# EAGLE design PiZero2 (EAGLE 7.6.0)
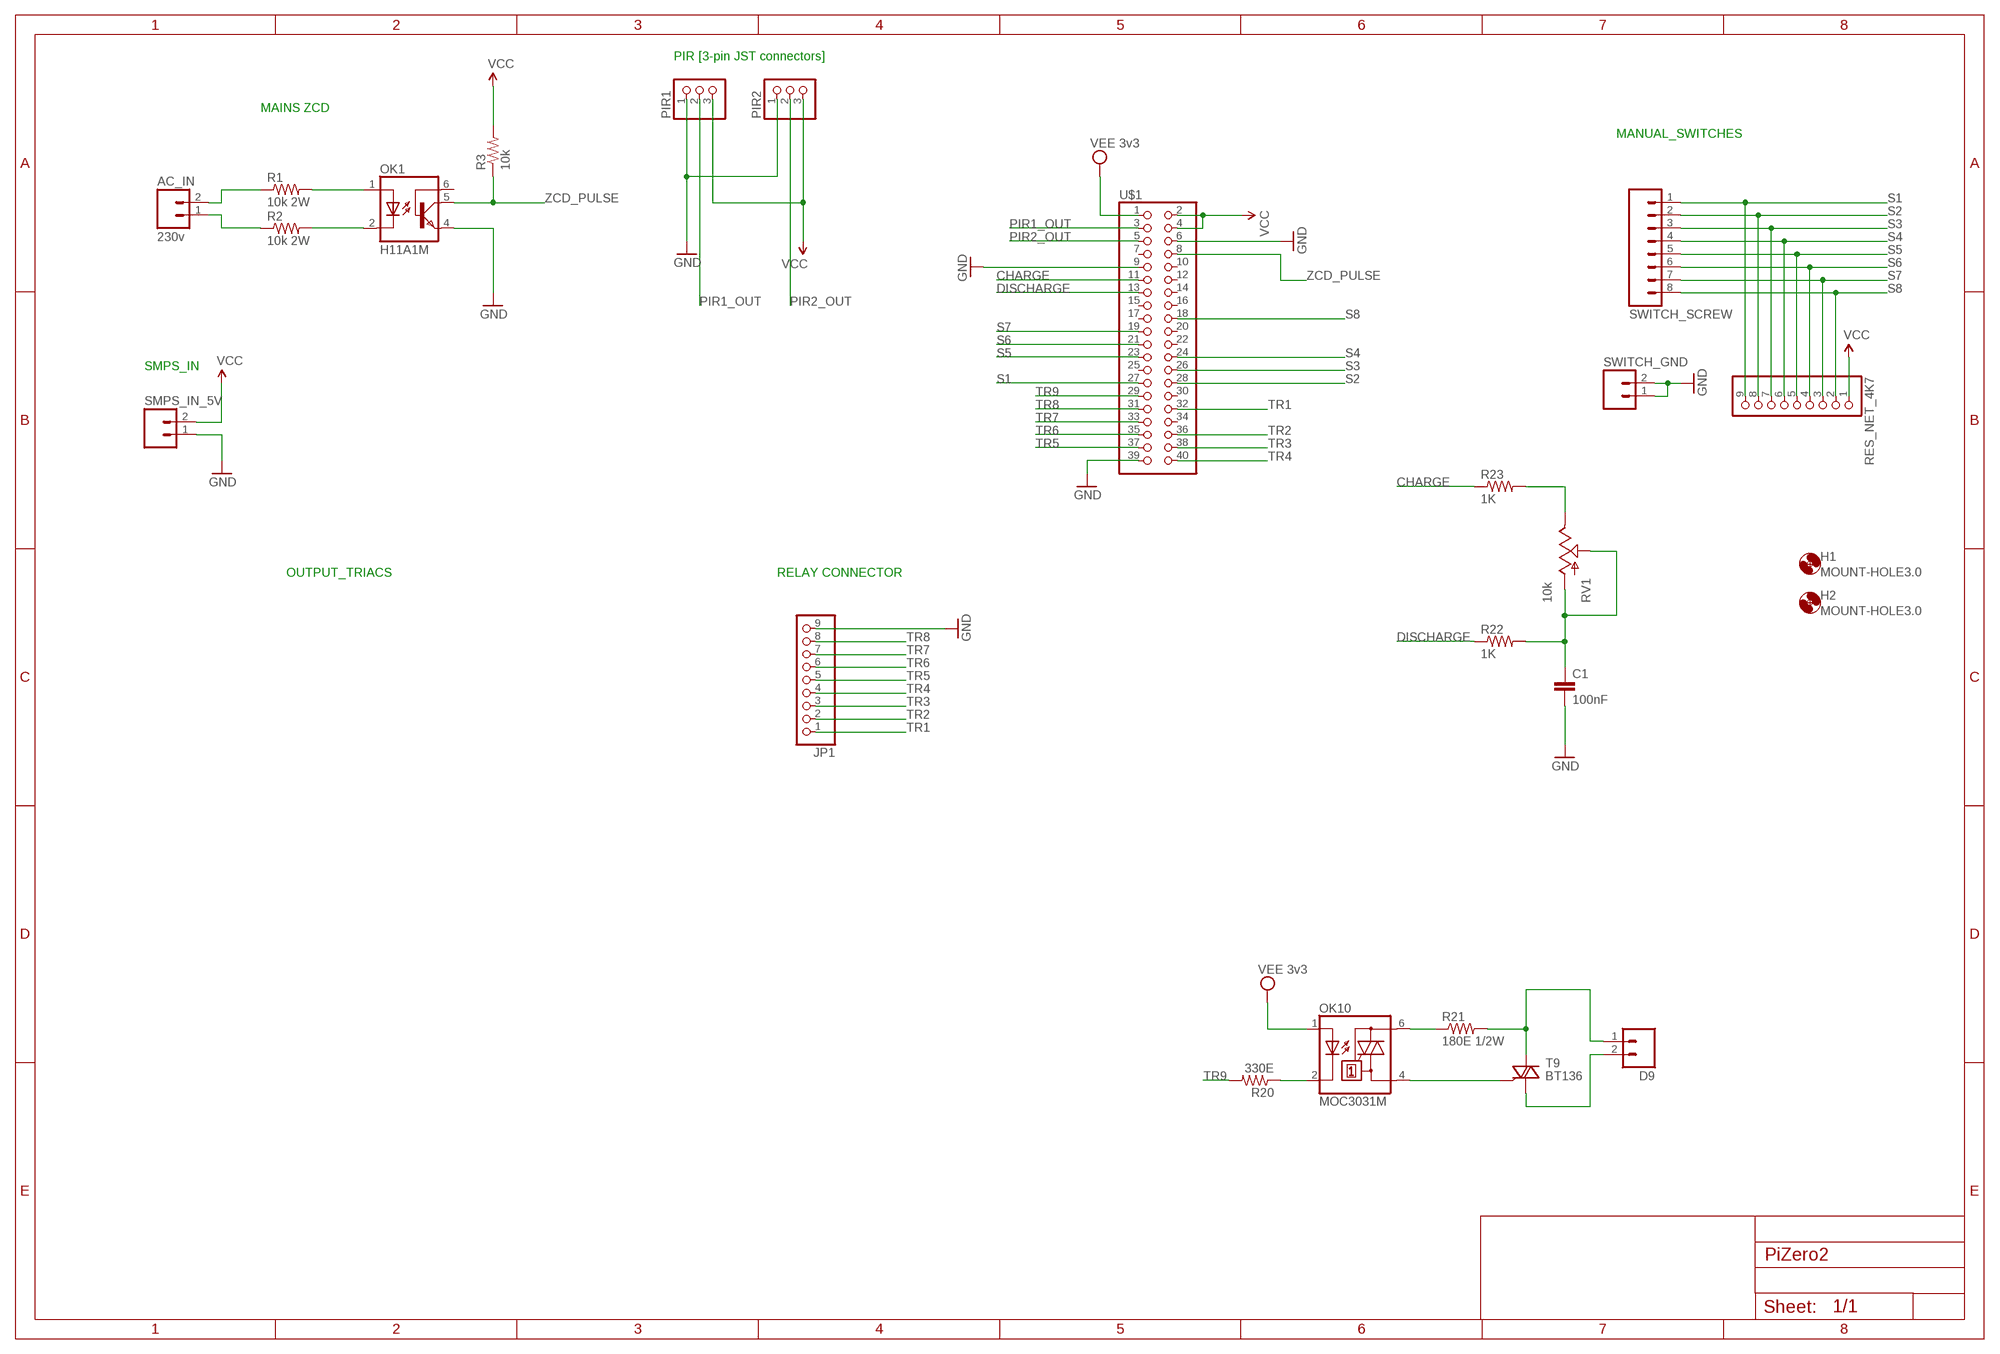
[diagram p0: schematic, sheet 1]

## Parts
AC_IN  230v  M023.5MM_LOCK  [SCREWTERMINAL-3.5MM-2_LOCK]
C1  100nF  C-EU025-025X050  [C025-025X050]
D9  M023.5MM_LOCK  [SCREWTERMINAL-3.5MM-2_LOCK]
H1  MOUNT-HOLE3.0  [3,0]
H2  MOUNT-HOLE3.0  [3,0]
JP1  PINHD-1X9/90  [1X09/90]
OK1  H11A1M  [DIL06]
OK10  MOC3031M  [DIL06]
PIR1  PINHD-1X3  [1X03]
PIR2  PINHD-1X3  [1X03]
R1  10k 2W  RESISTORPTH-2W  [AXIAL-0.8]
R2  10k 2W  RESISTORPTH-2W  [AXIAL-0.8]
R3  10k  RESISTORPTH-1/4W  [AXIAL-0.4]
R20  330E  RESISTORPTH-1/4W  [AXIAL-0.4]
R21  180E 1/2W  RESISTORPTH-1/2W  [AXIAL-0.5]
R22  1K  RESISTORPTH-1/4W  [AXIAL-0.4]
R23  1K  RESISTORPTH-1/4W  [AXIAL-0.4]
RES_NET_4K7  PINHD-1X9  [1X09]
RV1  10k  POT100K_3362U  [3362U]
SMPS_IN_5V  M023.5MM_LOCK  [SCREWTERMINAL-3.5MM-2_LOCK]
SWITCH_GND  M023.5MM  [SCREWTERMINAL-3.5MM-2]
SWITCH_SCREW  M083.5MM-8  [SCREWTERMINAL-3.5MM-8]
T9  BT136  [TO220AB]
U$1  PINHD-2X20  [2X20]

## Nets
CHARGE: R23.P$1 U$1.11
DISCHARGE: R22.P$1 U$1.13
GND: C1.2 JP1.9 OK1.4(EMI) PIR1.1 PIR2.1 SMPS_IN_5V.1 SWITCH_GND.1 SWITCH_GND.2 U$1.6 U$1.9 U$1.39
N$1: AC_IN.2 R1.P$1
N$2: AC_IN.1 R2.P$1
N$3: OK1.1(A) R1.P$2
N$4: OK1.2(C) R2.P$2
N$45: OK10.6(A2) R21.P$1
N$46: D9.1 R21.P$2 T9.2(A2)
N$47: OK10.4(A1) T9.3(G)
N$48: D9.2 T9.1(A1)
N$49: OK10.2(C) R20.P$1
N$50: C1.1 R22.P$2 RV1.P$2(S) RV1.P$3(A)
N$52: R23.P$2 RV1.P$1(E)
PIR1_OUT: PIR1.2 U$1.3
PIR2_OUT: PIR2.2 U$1.5
S1: RES_NET_4K7.9 SWITCH_SCREW.1 U$1.27
S2: RES_NET_4K7.8 SWITCH_SCREW.2 U$1.28
S3: RES_NET_4K7.7 SWITCH_SCREW.3 U$1.26
S4: RES_NET_4K7.6 SWITCH_SCREW.4 U$1.24
S5: RES_NET_4K7.5 SWITCH_SCREW.5 U$1.23
S6: RES_NET_4K7.4 SWITCH_SCREW.6 U$1.21
S7: RES_NET_4K7.3 SWITCH_SCREW.7 U$1.19
S8: RES_NET_4K7.2 SWITCH_SCREW.8 U$1.18
TR1: JP1.1 U$1.32
TR2: JP1.2 U$1.36
TR3: JP1.3 U$1.38
TR4: JP1.4 U$1.40
TR5: JP1.5 U$1.37
TR6: JP1.6 U$1.35
TR7: JP1.7 U$1.33
TR8: JP1.8 U$1.31
TR9: R20.P$2 U$1.29
VCC: PIR1.3 PIR2.3 R3.P$2 RES_NET_4K7.1 SMPS_IN_5V.2 U$1.2 U$1.4
VEE: OK10.1(A) U$1.1 ; supply symbol labelled VEE 3v3
ZCD_PULSE: OK1.5(COL) R3.P$1 U$1.8
Unconnected: OK1.6(BAS) U$1.7 U$1.10 U$1.12 U$1.14 U$1.15 U$1.16 U$1.17 U$1.20 U$1.22 U$1.25 U$1.30 U$1.34

## Notes on the sheet
- PIR [3-pin JST connectors]
- MAINS ZCD
- MANUAL_SWITCHES
- SMPS_IN
- OUTPUT_TRIACS | RELAY CONNECTOR

## Library data of the parts
AC_IN D9 SMPS_IN_5V SWITCH_GND = SparkFun-Connectors:M02: Standard 2-pin 0.1" header. Use with - straight break away headers ( PRT-00116) - right angle break away headers (PRT-00553) - swiss pins (PRT-00743) - machine pins (PRT-00117) - female headers (PRT-00115) Molex polarized connector foot print use with: PRT-08233 with associated crimp pins and housings. 2.54_SCREWTERM for use with PRT-10571. 3.5mm Screw Terminal footprints for PRT-08084 5mm Screw Terminal footprints for use with PRT-08432; PROD_ID: CONN-08399
C1 = resistor:C-EU: CAPACITOR, European symbol
H1 H2 = holes:MOUNT-HOLE: MOUNTING HOLE with drill center marker
JP1 RES_NET_4K7 = pinhead:PINHD-1X9: PIN HEADER
OK1 = optocoupler:H11A*?M: General Purpose 6-Pin Phototransistor Optocouplers Source: http://www.fairchildsemi.com/ds/4N/4N35-M.pdf; MPN: H11A1-M; OC_FARNELL: 1021358; OC_NEWARK: 97K1793
OK10 = optocoupler:MOC30*: 6-Pin DIP Zero-Cross Optoisolators Triac Driver Output (250/400 Volt Peak) Source: Data sheet <http://www.fairchildsemi.com/ds/MO/MOC3031M.pdf> The old path of data sheet not more available 2013-05-06.; MF: FAIRCHILD SEMICONDUCTOR; MPN: MOC3031M; OC_FARNELL: 9875964; OC_NEWARK: 78K6089
PIR1 PIR2 = pinhead:PINHD-1X3: PIN HEADER
R1-R3 R20-R23 = SparkFun-Passives:RESISTOR: Resistor Basic schematic elements and footprints for 0603, 1206, and PTH resistors.
RV1 = SparkFun-Electromechanical:POT
SWITCH_SCREW = SparkFun-Connectors:M08: Header 8 Standard 8-pin 0.1" header. Use with straight break away headers (SKU : PRT-00116), right angle break away headers (PRT-00553), swiss pins (PRT-00743), machine pins (PRT-00117), and female headers (PRT-00115).
T9 = triac:BT136: Triac BT136 series E sensitive gate Source: http://www.nxp.com/acrobat_download/datasheets/BT136_SERIES_E_2.pdf
U$1 = pinhead:PINHD-2X20: PIN HEADER

## Board
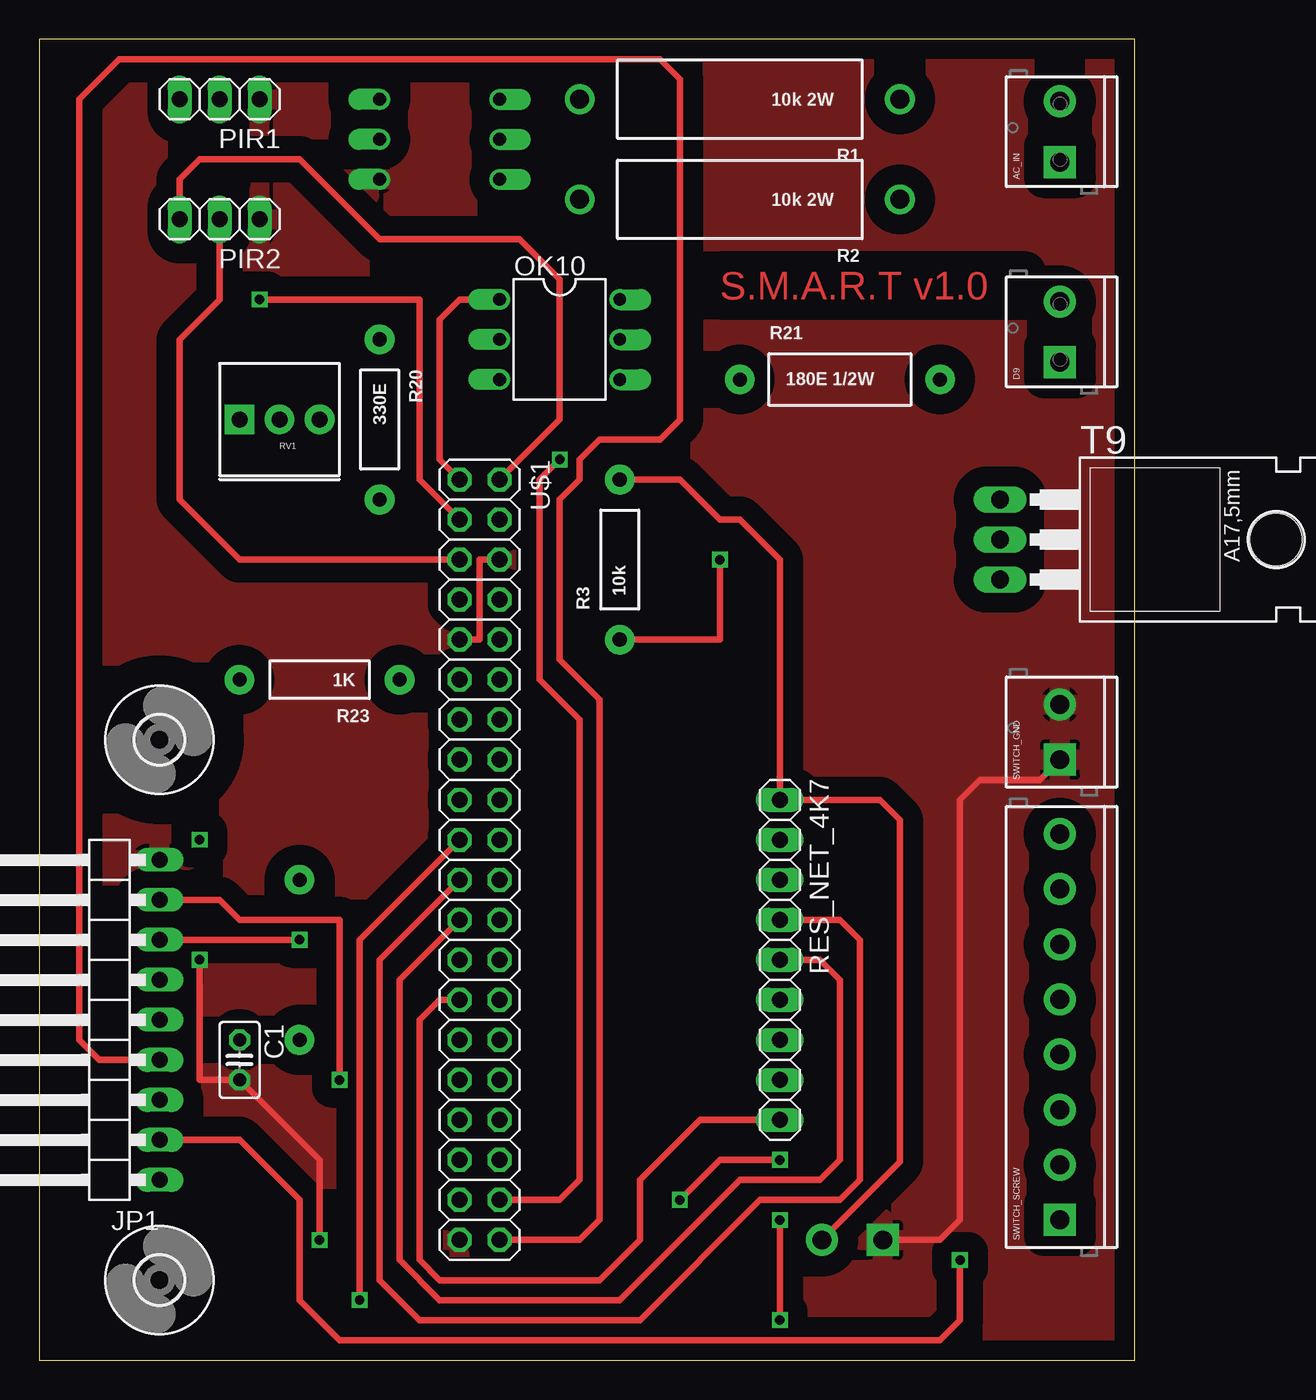
[diagram p1: board, top side]
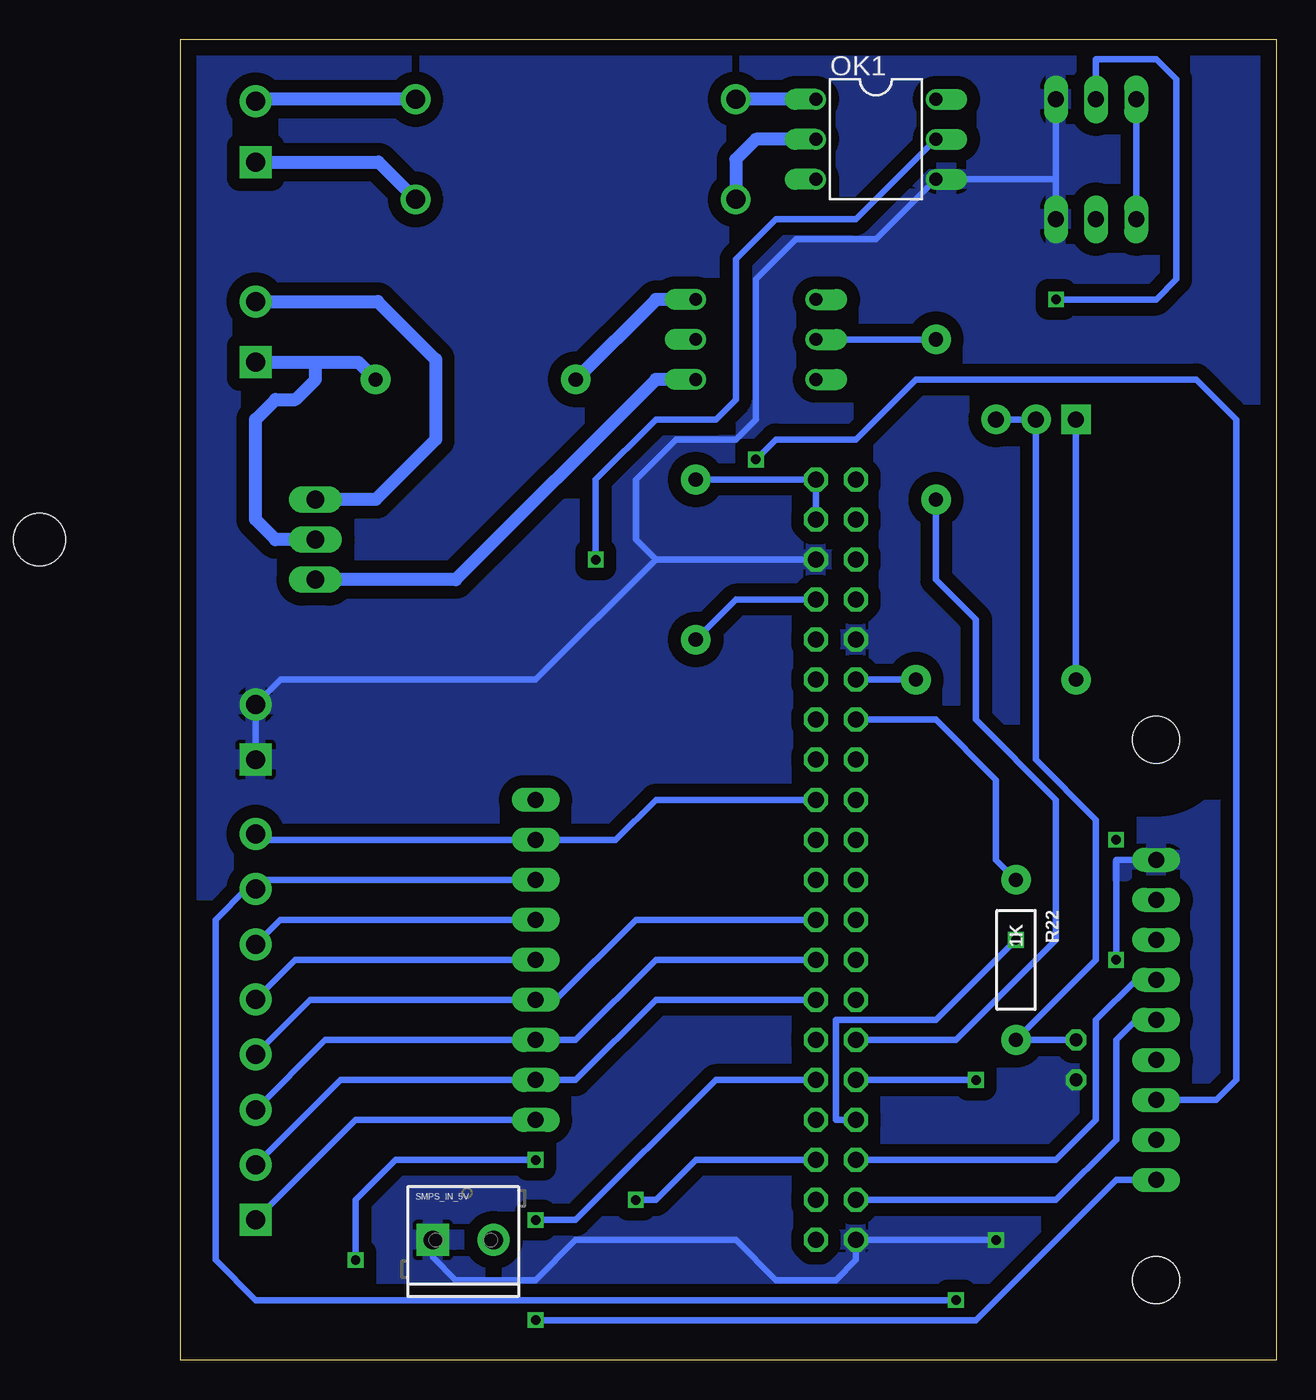
[diagram p2: board, bottom side, seen from below]

Size 69.52 x 83.81 mm. Coordinates in mm from the lower left corner, seen from the top.
Outline: 0,0 69.52,0 69.52,83.81 0,83.81 0,0
Copper layers (1*16): Top 0.035mm / dielectric 1.5mm / Bottom 0.035mm
Design rules "default": minimum track width 10mil, minimum drill 24mil, track to track 8mil, track to pad 8mil, pad to pad 8mil, via to via 8mil, smd to smd 8mil, copper to edge 40mil, drill to drill 8mil, minimum pad ring 10mil, minimum via ring 8mil, stop-mask expansion 4mil, vias tented up to drill 0mil, thermal gap 10mil

### Footprints (pad centres in the part's own frame; a part is rotated, then mirrored left to right if it is on the bottom)
SCREWTERMINAL-3.5MM-2_LOCK = drill 1.2 pad 2.032 square: 1 -0.178,0 | drill 1.2 pad 2.032: 2 3.678,0
C025-025X050 = drill 0.813 octagon: 1 -1.27,0; 2 1.27,0
3,0 = hole 3: 0,0
1X09/90 = drill 1.016 long: 1 -10.16,-3.81; 2 -7.62,-3.81; 3 -5.08,-3.81; 4 -2.54,-3.81; 5 0,-3.81; 6 2.54,-3.81; 7 5.08,-3.81; 8 7.62,-3.81; 9 10.16,-3.81
DIL06 = drill 0.813 offset: 1 -2.54,-3.81; 2 0,-3.81; 3 2.54,-3.81; 4 2.54,3.81; 5 0,3.81; 6 -2.54,3.81
1X03 = drill 1.016 long: 1 -2.54,0; 2 0,0; 3 2.54,0
AXIAL-0.8 = drill 1.2 pad 1.88: P$1 -10.16,0; P$2 10.16,0
AXIAL-0.4 = drill 0.9 pad 1.88: P$1 -5.08,0; P$2 5.08,0
AXIAL-0.5 = drill 0.9 pad 1.88: P$1 -6.35,0; P$2 6.35,0
1X09 = drill 1.016 long: 1 -10.16,0; 2 -7.62,0; 3 -5.08,0; 4 -2.54,0; 5 0,0; 6 2.54,0; 7 5.08,0; 8 7.62,0; 9 10.16,0
3362U = drill 1.016 pad 1.88 square: P$1 0,2.54 | drill 1.016 pad 1.88: P$2 2.54,2.54; P$3 5.08,2.54
SCREWTERMINAL-3.5MM-2 = drill 1.2 pad 2.032 square: 1 0,0 | drill 1.2 pad 2.032: 2 3.5,0
SCREWTERMINAL-3.5MM-8 = drill 1.2 pad 2.032 square: 1 0,0 | drill 1.2 pad 2.032: 2 3.5,0; 3 7,0; 4 10.5,0; 5 14,0; 6 17.5,0; 7 21,0; 8 24.5,0
TO220AB = drill 1.118 long: 1 -2.54,-6.35; 2 0,-6.35; 3 2.54,-6.35 | hole 3.302: 0,11.176
2X20 = drill 1.016 octagon: 1 -24.13,-1.27; 2 -24.13,1.27; 3 -21.59,-1.27; 4 -21.59,1.27; 5 -19.05,-1.27; 6 -19.05,1.27; 7 -16.51,-1.27; 8 -16.51,1.27; 9 -13.97,-1.27; 10 -13.97,1.27; 11 -11.43,-1.27; 12 -11.43,1.27; 13 -8.89,-1.27; 14 -8.89,1.27; 15 -6.35,-1.27; 16 -6.35,1.27; 17 -3.81,-1.27; 18 -3.81,1.27; 19 -1.27,-1.27; 20 -1.27,1.27; 21 1.27,-1.27; 22 1.27,1.27; 23 3.81,-1.27; 24 3.81,1.27; 25 6.35,-1.27; 26 6.35,1.27; 27 8.89,-1.27; 28 8.89,1.27; 29 11.43,-1.27; 30 11.43,1.27; 31 13.97,-1.27; 32 13.97,1.27; 33 16.51,-1.27; 34 16.51,1.27; 35 19.05,-1.27; 36 19.05,1.27; 37 21.59,-1.27; 38 21.59,1.27; 39 24.13,-1.27; 40 24.13,1.27

### Placement (x,y rotation side)
AC_IN  64.77,76.2 90 top
C1  12.7,19.05 270 top
D9  64.77,63.5 90 top
H1  7.62,5.08 0 top
H2  7.62,39.37 0 top
JP1  3.81,21.59 90 top
OK1  25.4,77.47 270 bottom
OK10  33.02,64.77 270 top
PIR1  11.43,80.01 180 top
PIR2  11.43,72.39 180 top
R1  44.45,80.01 180 top
R2  44.45,73.66 180 top
R3  36.83,50.8 90 top
R20  21.59,59.69 270 top
R21  50.8,62.23 0 top
R22  16.51,25.4 270 bottom
R23  17.78,43.18 180 top
RES_NET_4K7  46.99,25.4 270 top
RV1  12.7,57.15 0 top
SMPS_IN_5V  53.34,7.62 0 bottom
SWITCH_GND  64.77,38.1 90 top
SWITCH_SCREW  64.77,8.89 90 top
T9  67.31,52.07 270 top
U$1  27.94,31.75 270 top

### Tracks (layer width: path | path; a pad name or v marks a point on that pad's centre or on a via)
CHARGE
  Bottom 0.406: U$1.11 R23.P$1
DISCHARGE
  Bottom 0.406: U$1.13 21.59,40.64 17.78,36.83 17.78,31.75 R22.P$1
GND  (via drill 0.6)
  Top 0.406: SWITCH_GND.1 63.5,36.83 59.69,36.83 58.42,35.56 58.42,8.89 57.15,7.62 SMPS_IN_5V.1 | v10.16,25.4 10.16,17.78 C1.2 17.78,12.7 v17.78,7.62 | U$1.6 27.94,50.8 27.94,45.72 U$1.9
  Bottom 0.406: SWITCH_GND.1 SWITCH_GND.2 63.19,43.18 46.99,43.18 39.37,50.8 | PIR1.1 13.97,74.93 | 13.97,74.93 PIR2.1 | 13.97,74.93 OK1.4 25.4,71.12 30.48,71.12 33.02,68.58 33.02,59.69 34.29,58.42 38.1,58.42 40.64,55.88 40.64,52.07 39.37,50.8 | 39.37,50.8 U$1.6 | SMPS_IN_5V.1 53.52,6.53 52.07,5.08 46.99,5.08 44.45,7.62 34.29,7.62 31.75,5.08 27.94,5.08 26.67,6.35 U$1.39 v17.78,7.62 | JP1.9 10.16,31.75 v10.16,25.4
  pour Bottom (isolate 0.813): 0,83.82 69.85,83.82 69.85,0 0,0
  pour Top (isolate 1.27): 0,83.82 69.85,83.82 69.85,0 0,0
N$1
  Bottom 0.813: R1.P$1 64.77,80.01 AC_IN.2
N$2
  Bottom 0.813: AC_IN.1 56.97,76.02 R2.P$1
N$3
  Bottom 0.813: OK1.1 R1.P$2
N$4
  Bottom 0.813: OK1.2 33.02,77.47 34.29,76.2 R2.P$2
N$5  (via drill 0.6)
  other vias: 10.16,33.02
N$45
  Bottom 0.813: OK10.6 39.37,67.31 R21.P$1
N$46
  Bottom 0.813: D9.1 60.96,63.32 | 60.96,63.32 58.24,63.32 R21.P$2 | T9.2 63.5,52.07 64.77,53.34 64.77,59.69 63.5,60.96 62.23,60.96 60.96,62.23 60.96,63.32
N$47
  Bottom 0.813: OK10.4 39.37,62.23 52.07,49.53 T9.3
N$48
  Bottom 0.813: D9.2 57.02,67.18 53.34,63.5 53.34,58.42 57.15,54.61 T9.1
N$49
  Bottom 0.406: OK10.2 R20.P$1
N$50
  Bottom 0.406: RV1.P$3 RV1.P$2 15.24,38.1 11.43,34.29 11.43,25.4 R22.P$2 C1.1
N$52
  Bottom 0.406: R23.P$2 RV1.P$1
PIR1_OUT  (via drill 0.6)
  Top 0.406: U$1.3 24.13,55.88 24.13,67.31 v13.97,67.31
  Bottom 0.406: v13.97,67.31 7.62,67.31 6.35,68.58 6.35,81.28 7.62,82.55 11.43,82.55 PIR1.2
PIR2_OUT
  Top 0.406: PIR2.2 11.43,67.31 8.89,64.77 8.89,54.61 12.7,50.8 U$1.5
S1
  Top 0.406: U$1.27 25.4,22.86 24.13,21.59 24.13,6.35 25.4,5.08 35.56,5.08 38.1,7.62 38.1,11.43 41.91,15.24 RES_NET_4K7.9
  Bottom 0.406: RES_NET_4K7.9 58.42,15.24 SWITCH_SCREW.1
S2
  Bottom 0.406: SWITCH_SCREW.2 59.38,17.78 RES_NET_4K7.8 44.45,17.78 39.37,22.86 U$1.28
S3
  Bottom 0.406: SWITCH_SCREW.3 60.34,20.32 RES_NET_4K7.7 44.45,20.32 39.37,25.4 U$1.26
S4
  Bottom 0.406: SWITCH_SCREW.4 61.3,22.86 RES_NET_4K7.6 45.72,22.86 40.64,27.94 U$1.24
S5
  Top 0.406: U$1.23 22.86,24.13 22.86,6.35 25.4,3.81 36.83,3.81 44.45,11.43 49.53,11.43 50.8,12.7 50.8,24.13 49.53,25.4 RES_NET_4K7.5
  Bottom 0.406: RES_NET_4K7.5 62.26,25.4 SWITCH_SCREW.5
S6
  Top 0.406: U$1.21 21.59,25.4 21.59,5.08 24.13,2.54 38.1,2.54 45.72,10.16 50.8,10.16 52.07,11.43 52.07,26.67 50.8,27.94 RES_NET_4K7.4
  Bottom 0.406: RES_NET_4K7.4 63.22,27.94 SWITCH_SCREW.6
S7  (via drill 0.6)
  Top 0.406: U$1.19 20.32,26.67 v20.32,3.81
  Bottom 0.406: RES_NET_4K7.3 64.18,30.48 SWITCH_SCREW.7 65.36,29.89 67.31,27.94 67.31,6.35 64.77,3.81 v20.32,3.81
S8
  Bottom 0.406: SWITCH_SCREW.8 64.4,33.02 RES_NET_4K7.2 41.91,33.02 39.37,35.56 U$1.18
TR1  (via drill 0.6)
  Top 0.406: v46.99,8.89 v46.99,2.54
  Bottom 0.406: U$1.32 35.56,17.78 44.45,8.89 v46.99,8.89 | v46.99,2.54 19.05,2.54 10.16,11.43 JP1.1
TR2  (via drill 0.6)
  Top 0.406: v40.64,10.16 43.18,12.7 v46.99,12.7 | v58.42,6.35 58.42,2.54 57.15,1.27 19.05,1.27 16.51,3.81 16.51,10.16 12.7,13.97 JP1.2
  Bottom 0.406: U$1.36 36.83,12.7 39.37,10.16 v40.64,10.16 | v46.99,12.7 55.88,12.7 58.42,10.16 v58.42,6.35
TR3  (via drill 0.6)
  Top 0.406: U$1.38 33.02,10.16 34.29,11.43 34.29,40.64 31.75,43.18 31.75,55.88 v33.02,57.15
  Bottom 0.406: v33.02,57.15 31.75,58.42 26.67,58.42 22.86,62.23 5.08,62.23 2.54,59.69 2.54,17.78 3.81,16.51 JP1.3
TR4
  Top 0.406: U$1.40 34.29,7.62 35.56,8.89 35.56,41.91 33.02,44.45 33.02,54.61 34.29,55.88 34.29,57.15 35.56,58.42 39.37,58.42 40.64,59.69 40.64,81.28 39.37,82.55 5.08,82.55 2.54,80.01 2.54,20.32 3.81,19.05 JP1.4
TR5
  Bottom 0.406: U$1.37 13.97,10.16 10.16,13.97 10.16,20.32 8.89,21.59 JP1.5
TR6
  Bottom 0.406: U$1.35 13.97,12.7 11.43,15.24 11.43,21.59 8.89,24.13 JP1.6
TR7  (via drill 0.6)
  Top 0.406: JP1.7 v16.51,26.67
  Bottom 0.406: v16.51,26.67 21.59,21.59 27.94,21.59 27.94,15.24 U$1.33
TR8  (via drill 0.6)
  Top 0.406: v19.05,17.78 19.05,27.94 12.7,27.94 11.43,29.21 JP1.8
  Bottom 0.406: U$1.31 v19.05,17.78
TR9
  Bottom 0.406: R20.P$2 21.59,49.53 19.05,46.99 19.05,40.64 13.97,35.56 13.97,26.67 20.32,20.32 U$1.29
VCC
  Top 0.406: PIR2.3 8.89,74.93 10.16,76.2 16.51,76.2 21.59,71.12 30.48,71.12 33.02,68.58 33.02,59.69 U$1.2 | R3.P$2 40.64,55.88 43.18,53.34 44.45,53.34 46.99,50.8 RES_NET_4K7.1 53.34,35.56 54.61,34.29 54.61,12.57 SMPS_IN_5V.2
  Bottom 0.406: R3.P$2 U$1.2 U$1.4 | PIR1.3 PIR2.3
VEE
  Top 0.406: OK10.1 26.67,67.31 25.4,66.04 25.4,57.15 U$1.1
ZCD_PULSE  (via drill 0.6)
  Top 0.406: v43.18,50.8 43.18,45.72 R3.P$1
  Bottom 0.406: U$1.8 34.29,48.26 R3.P$1 | OK1.5 26.67,72.39 31.75,72.39 34.29,69.85 34.29,60.96 35.56,59.69 39.37,59.69 43.18,55.88 v43.18,50.8

### Text on the board
Top: S.M.A.R.T v1.0